# Altium schematic sheet caton-scum3c.SchDoc
size A; SheetNumber: 1; SheetTotal: 1
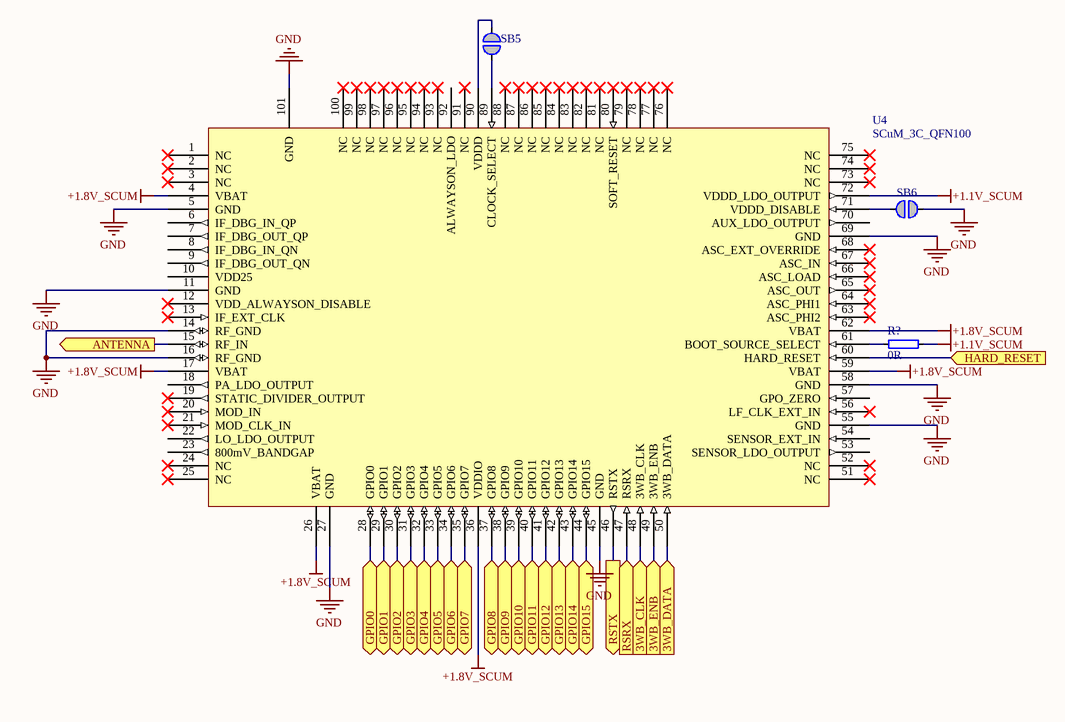
[diagram p0: caton-scum3c.SchDoc]

## Parts
R?  0R  [RESC0603X03L_C]
SB5  Solderbridge  [Solderbridge]  (value not drawn)  (no BOM)
SB6  Solderbridge  [Solderbridge]  (value not drawn)  (no BOM)
U4  SCuM_3C_QFN100  [QFN40P1200X1200X150_HS-101N]

## Ports
3WB_CLK (in), 3WB_DATA (in), 3WB_ENB (in), ANTENNA (out), GPIO0 (bidir), GPIO1 (bidir), GPIO2 (bidir), GPIO3 (bidir), GPIO4 (bidir), GPIO5 (bidir), GPIO6 (bidir), GPIO7 (bidir), GPIO8 (bidir), GPIO9 (bidir), GPIO10 (bidir), GPIO11 (bidir), GPIO12 (bidir), GPIO13 (bidir), GPIO14 (bidir), GPIO15 (bidir), HARD_RESET (in), RSRX (in), RSTX (out)

## Nets
+1.1V_SCUM: R?.2 U4.72(VDDD_LDO_OUTPUT)
+1.8V_SCUM: U4.4(VBAT) U4.17(VBAT) U4.26(VBAT) U4.36(VDDIO) U4.59(VBAT) U4.62(VBAT)
GND: SB6.2 U4.5(GND) U4.11(GND) U4.14(RF_GND) U4.16(RF_GND) U4.27(GND) U4.45(GND) U4.55(GND) U4.58(GND) U4.69(GND) U4.101(GND)
3WB_CLK: U4.48(3WB_CLK) ; port 3WB_CLK
3WB_DATA: U4.50(3WB_DATA) ; port 3WB_DATA
3WB_ENB: U4.49(3WB_ENB) ; port 3WB_ENB
ANTENNA: U4.15(RF_IN) ; port ANTENNA
GPIO0: U4.28(GPIO0) ; port GPIO0
GPIO1: U4.29(GPIO1) ; port GPIO1
GPIO2: U4.30(GPIO2) ; port GPIO2
GPIO3: U4.31(GPIO3) ; port GPIO3
GPIO4: U4.32(GPIO4) ; port GPIO4
GPIO5: U4.33(GPIO5) ; port GPIO5
GPIO6: U4.34(GPIO6) ; port GPIO6
GPIO7: U4.35(GPIO7) ; port GPIO7
GPIO8: U4.37(GPIO8) ; port GPIO8
GPIO9: U4.38(GPIO9) ; port GPIO9
GPIO10: U4.39(GPIO10) ; port GPIO10
GPIO11: U4.40(GPIO11) ; port GPIO11
GPIO12: U4.41(GPIO12) ; port GPIO12
GPIO13: U4.42(GPIO13) ; port GPIO13
GPIO14: U4.43(GPIO14) ; port GPIO14
GPIO15: U4.44(GPIO15) ; port GPIO15
HARD_RESET: U4.60(HARD_RESET) ; port HARD_RESET
RSRX: U4.47(RSRX) ; port RSRX
RSTX: U4.46(RSTX) ; port RSTX
NetR?_1: R?.1 U4.61(BOOT_SOURCE_SELECT)
NetSB5_1: SB5.1 U4.90(VDDD)
NetSB5_2: SB5.2 U4.89(CLOCK_SELECT)
NetSB6_1: SB6.1 U4.71(VDDD_DISABLE)

Not connected (* = marked no-connect by the designer): U4 1(NC)* 2(NC)* 3(NC)* 6(IF_DBG_IN_QP) 7(IF_DBG_OUT_QP) 8(IF_DBG_IN_QN) 9(IF_DBG_OUT_QN) 10(VDD25) 12(VDD_ALWAYSON_DISABLE)* 13(IF_EXT_CLK)* 18(PA_LDO_OUTPUT) 19(STATIC_DIVIDER_OUTPUT)* 20(MOD_IN)* 21(MOD_CLK_IN)* 22(LO_LDO_OUTPUT) 23(800mV_BANDGAP) 24(NC)* 25(NC)* 51(NC)* 52(NC)* 53(SENSOR_LDO_OUTPUT) 54(SENSOR_EXT_IN) 56(LF_CLK_EXT_IN)* 57(GPO_ZERO) 63(ASC_PHI2)* 64(ASC_PHI1)* 65(ASC_OUT)* 66(ASC_LOAD)* 67(ASC_IN)* 68(ASC_EXT_OVERRIDE)* 70(AUX_LDO_OUTPUT) 73(NC)* 74(NC)* 75(NC)* 76(NC)* 77(NC)* 78(NC)* 79(NC)* 80(SOFT_RESET)* 81(NC)* 82(NC)* 83(NC)* 84(NC)* 85(NC)* 86(NC)* 87(NC)* 88(NC)* 91(NC)* 92(ALWAYSON_LDO) 93(NC)* 94(NC)* 95(NC)* 96(NC)* 97(NC)* 98(NC)* 99(NC)* 100(NC)*

## Library data of the parts
R? = R0201-0R: Resistor, ±5%, 0.05W; Manufacturer: N.A.; Part number IPS: 00000003245; Note: Chip Res 5%; Pad Count: 2; Part Number: R0201-0R; Manufacturer Part Number: N.A.; LatestRevisionDate: 2017-11-09; Published: 2014-11-13; Value: 0R; Artikkelnr Noca: N.A.; Footprint Doc: 0201; ComponentLink1Description: Datasheet; ComponentLink1URL: N.A.; ComponentLink2Description: Supplier link; ComponentLink2URL: N.A.; HelpURL: N.A.; Supplier 1: N.A.; Supplier Part Number 1: N.A.; Supplier 2: N.A.; Supplier Part Number 2: N.A.; PartId: 100100001; Component Class: Resistors; Author: rsk; Part number Norautron: N.A.
SB5 SB6 = Solderbridge: Manufacturer: N.A.; Pad Count: 2; Part Number: Solderbridge; Manufacturer Part Number: N.A.; Footprint Doc: Solderbridge; LatestRevisionDate: 2009-12-14; Published: 2009-12-14; Value: Solderbridge; Note: N.A.; Artikkelnr Noca: N.A.; Part number IPS: N.A.; ComponentLink1Description: Datasheet; ComponentLink1URL: N.A.; ComponentLink2Description: Supplier link; ComponentLink2URL: N.A.; HelpURL: N.A.; Supplier 1: N.A.; Supplier Part Number 1: N.A.; Supplier 2: N.A.; Supplier Part Number 2: N.A.; PartId: 100500458; Component Class: Connectors; Author: rsk; Part number Norautron: N.A.